# Altium schematic sheet 4_p3_audio&video&Gsensor.schdoc
size 307 x 218 mm; Symbol: Sheet-Symbol_A4; Device: Sheet-Symbol_A4; @Project Name: ai_camera; @Page Count: 5; @Update Date: 2026-03-17; @Create Date: 2026-03-10; @Schematic Name: Schematic1; @Page No: 4; @Page Name: p3_audio&video&Gsensor; @Board Name: Board1; Company: 嘉立创EDA; Version: V1.0; Page Size: A4; Convert to PCB: yes; Add into BOM: yes; Title Block Position: 3; Width: 1170; Height: 825; Region Start: 1; X Region Count: 6; Y Region Count: 4; Blade Width: 10; @Create Time: 07:12:56; @Update Time: 10:37:45
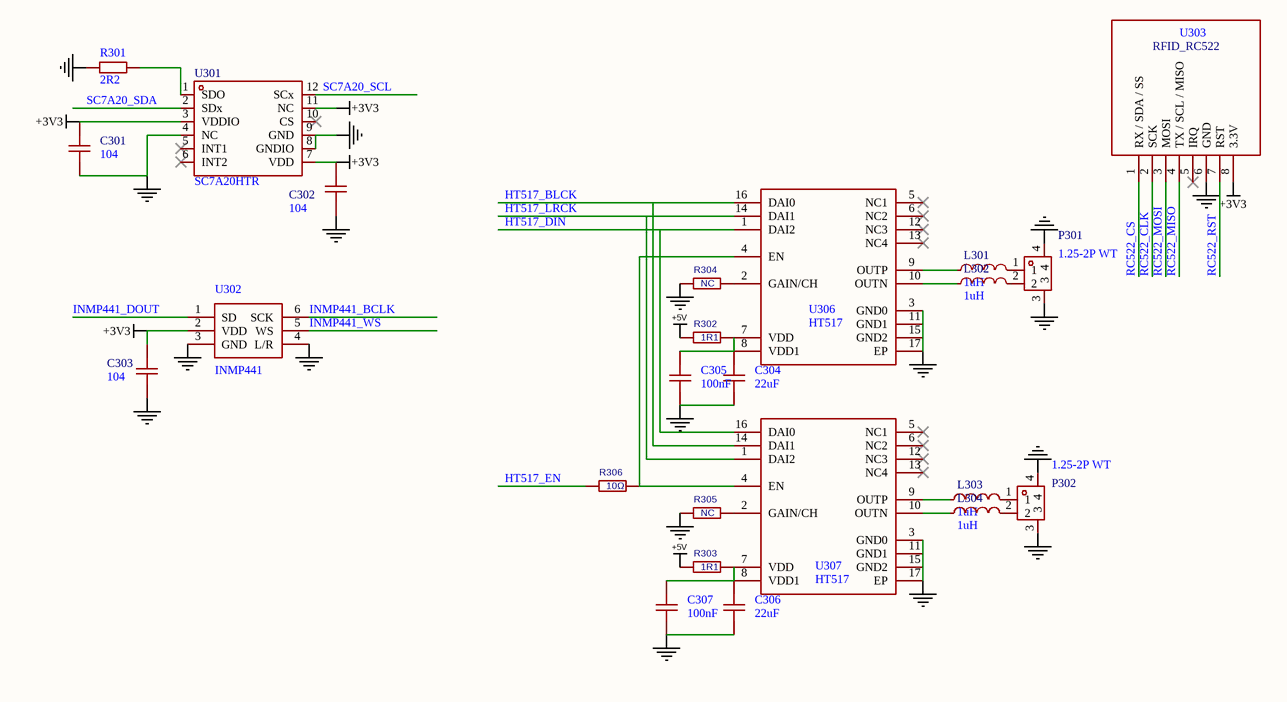
[diagram p0: 4_p3_audio&video&Gsensor.schdoc]

## Parts
C301  104  [C0603]
C302  104  [C0603]
C303  104  [C0603]
C304  22uF  [C0603]
C305  100nF  [C0603]
C306  22uF  [C0603]
C307  100nF  [C0603]
L301  1uH  [L0603]
L302  1uH  [L0603]
L303  1uH  [L0603]
L304  1uH  [L0603]
P301  1.25-2P WT  [CONN-SMD_1.25-2PWT]
P302  1.25-2P WT  [CONN-SMD_1.25-2PWT]
R301  2R2  [R0603]
R302  1R1  [R0805]
R303  1R1  [R0805]
R304  NC  [R0805]
R305  NC  [R0805]
R306  10Ω  [R0603]
U301  SC7A20HTR  [LGA-12_L2.0-W2.0-P0.50-TL]
U302  INMP441  [INMP441_MODULE]
U303  (no value)  [RFID_RC522]
U306  HT517  [QFN-16_L3.0-W3.0-P0.50-TL-EP1.7]
U307  HT517  [QFN-16_L3.0-W3.0-P0.50-TL-EP1.7]

## Nets
+3V3: C301.1 C302.2 C303.2 U301.3(VDDIO) U301.7(VDD) U301.11(NC) U302.2(VDD) U303.8(3.3V)
+5V: R302.?2 R303.?2
GND: C301.2 C302.1 C303.1 C304.1 C305.1 C306.1 C307.1 P301.3 P301.4 P302.3 P302.4 R301.1 R304.?2 R305.?2 U301.4(NC) U301.8(GNDIO) U301.9(GND) U302.3(GND) U302.4(L/R) U303.6(GND) U306.3(GND0) U306.11(GND1) U306.15(GND2) U306.17(EP) U307.3(GND0) U307.11(GND1) U307.15(GND2) U307.17(EP)
HT517_BLCK: U306.16(DAI0) U307.14(DAI1)
HT517_DIN: U306.1(DAI2) U307.16(DAI0)
HT517_EN: R306.?2
HT517_LRCK: U306.14(DAI1) U307.1(DAI2)
INMP441_BCLK: U302.6(SCK)
INMP441_DOUT: U302.1(SD)
INMP441_WS: U302.5(WS)
RC522_CLK: U303.2(SCK)
RC522_CS: U303.1(RX_/_SDA_/_SS)
RC522_MISO: U303.4(TX_/_SCL_/_MISO)
RC522_MOSI: U303.3(MOSI)
RC522_RST: U303.7(RST)
SC7A20_SCL: U301.12(SCx)
SC7A20_SDA: U301.2(SDx)
NetC304_2: C304.2 C305.2 R302.?1 U306.7(VDD) U306.8(VDD1)
NetC306_2: C306.2 C307.2 R303.?1 U307.7(VDD) U307.8(VDD1)
NetL301_1: L301.1 U306.9(OUTP)
NetL301_2: L301.2 P301.1
NetL302_1: L302.1 U306.10(OUTN)
NetL302_2: L302.2 P301.2
NetL303_1: L303.1 U307.9(OUTP)
NetL303_2: L303.2 P302.1
NetL304_1: L304.1 U307.10(OUTN)
NetL304_2: L304.2 P302.2
NetR301_2: R301.2 U301.1(SDO)
NetR304_?1: R304.?1 U306.2(GAIN/CH)
NetR305_?1: R305.?1 U307.2(GAIN/CH)
NetR306_?1: R306.?1 U306.4(EN) U307.4(EN)

Not connected (* = marked no-connect by the designer): U301 5(INT1)* 6(INT2)* 10(CS)*; U303 5(IRQ)*; U306 5(NC1)* 6(NC2)* 12(NC3)* 13(NC4)*; U307 5(NC1)* 6(NC2)* 12(NC3)* 13(NC4)*

## Notes on the sheet
- 1
- 2
- 3
- 4
- 5
- 6
- A
- B
- C
- 原理图
- Schematic1
- 创建日期
- 更新日期
- 2026-03-10
- 2026-03-17
- 绘制
- 板子
- Board1
- 图页
- p3_audio&video&Gsensor
- D
- 审阅
- 版本
- 尺寸
- ai_camera
- 页
- 共
- V1.0
- A4
- 嘉立创EDA

## Library data of the parts
C301-C303 = CGA0603X7R104K500JT: Manufacturer: HRE(芯声); Add into BOM: yes; Tolerance: ±10%; Voltage Rating: 50V; Temperature Coefficient: X7R; Symbol: CGA0603X7R104K500JT; Device: CGA0603X7R104K500JT; LCSC Part Name: 100nF ±10% 50V; Manufacturer Part: CGA0603X7R104K500JT; Supplier Footprint: 0603; JLCPCB Part Class: 扩展库; Datasheet: https://item.szlcsc.com/datasheet/CGA0603X7R104K500JT/7062573.html; Supplier: LCSC; Convert to PCB: yes; Value: 104
C304 C306 = CAP_0603: Symbol: CapAcitance; Convert to PCB: yes; Value: 100nF; Device: CAP_0603; Add into BOM: yes; Supplier Footprint: 0603
C305 C307 = CAP_0603: Symbol: CapAcitance; Convert to PCB: yes; Device: CAP_0603; Add into BOM: yes; Supplier Footprint: 0603; Value: 100nF
L301-L304 = L_0603: Symbol: SDFL1608S100KTF; Add into BOM: yes; Value: 10uH; Device: L_0603; Supplier Footprint: L0603; Convert to PCB: yes
P301 P302 = 1.25-2P WT: Manufacturer: SHOU HAN(首韩); Add into BOM: yes; Pitch: 1.25mm; Pins Structure: 1x2P; Number of PINs Per Row: 2; Gender: 公型插针; Current Rating (Max): 1A; Symbol: 1.25-2P WT; Device: 1.25-2P WT; LCSC Part Name: 1.25卧贴针座 1.25mm间距2P卧式贴片 WT指的是卧贴; Supplier Part: C668614; Manufacturer Part: 1.25-2P WT; Supplier Footprint: SMD,P=1.25mm; JLCPCB Part Class: Extended Part; Datasheet: https://atta.szlcsc.com/upload/public/pdf/source/20200618/C668614_A66416DD0743C4A51377B45DB73E146E.pdf; Supplier: LCSC; Convert to PCB: yes; Reference Series: -; Number of Rows: 1; Row Spacing: -; Mounting Style: 卧贴; Operating Temperature Range: -25℃~+85℃
R301 = Res_0603: Symbol: 电阻; Convert to PCB: yes; Value: 10K; Device: Res_0603; Add into BOM: yes; Supplier Footprint: 0603
R302-R305 = 0805W8F1002T5E_C17414: Manufacturer: UNI-ROYAL(厚声); Add into BOM: yes; Tolerance: ±1%; Power(Watts): 125mW; Overload Voltage (Max): 150V; Temperature Coefficient: ±100ppm/℃; Symbol: 0805W8F1002T5E; Device: 0805W8F1002T5E_C17414; Supplier: LCSC; Manufacturer Part: 0805W8F1002T5E; JLCPCB Part Class: Basic Part; LCSC Part Name: 10kΩ ±1% 125mW 厚膜电阻; Supplier Footprint: 0805; Datasheet: https://atta.szlcsc.com/upload/public/pdf/source/20200306/C422600_1E6D84923E4A46A82E41ADD87F860B5C.pdf; Convert to PCB: yes; Type: 厚膜电阻; Operating Temperature Range: -55℃~+155℃
  R302 R303: Value: 1R1
  R304 R305: Value: NC
R306 = CR0603FA10R0G: Manufacturer: LIZ(丽智电子); Symbol: 0805W8F1002T5E; Add into BOM: yes; Tolerance: ±1%; Power(Watts): 100mW; Temperature Coefficient: -500ppm/℃~+250ppm/℃; Overload Voltage (Max): 50V; Device: CR0603FA10R0G; Supplier: LCSC; Manufacturer Part: CR0603FA10R0G; Supplier Part: C100717; Value: 10Ω; JLCPCB Part Class: Extended Part; LCSC Part Name: 10Ω ±1% 100mW; Supplier Footprint: 0603; Datasheet: https://atta.szlcsc.com/upload/public/pdf/source/20170408/1491631265100.pdf; Convert to PCB: yes; Type: 厚膜电阻; Operating Temperature Range: -55℃~+125℃
U301 = SC7A20HTR: Manufacturer: SILAN(士兰微); Add into BOM: yes; Symbol: SC7A20HTR; Device: SC7A20HTR; LCSC Part Name: SC7A20HTR; Supplier Part: C19274408; Manufacturer Part: SC7A20HTR; Supplier Footprint: LGA-12(2x2); JLCPCB Part Class: 扩展库; Datasheet: https://item.szlcsc.com/datasheet/SC7A20HTR/20603496.html; Supplier: LCSC; Convert to PCB: yes
U302 = INMP441_module: Add into BOM: yes; Symbol: INMP441_module; Device: INMP441_module; Convert to PCB: yes
U303 = RFID_RC522: Add into BOM: yes; Symbol: RFID_RC522; Device: RFID_RC522; Convert to PCB: yes
U306 U307 = HT517: Add into BOM: yes; Symbol: HT517; Device: HT517; Convert to PCB: yes